# Altium schematic sheet Power-MCU-Breakout.SchDoc
size B
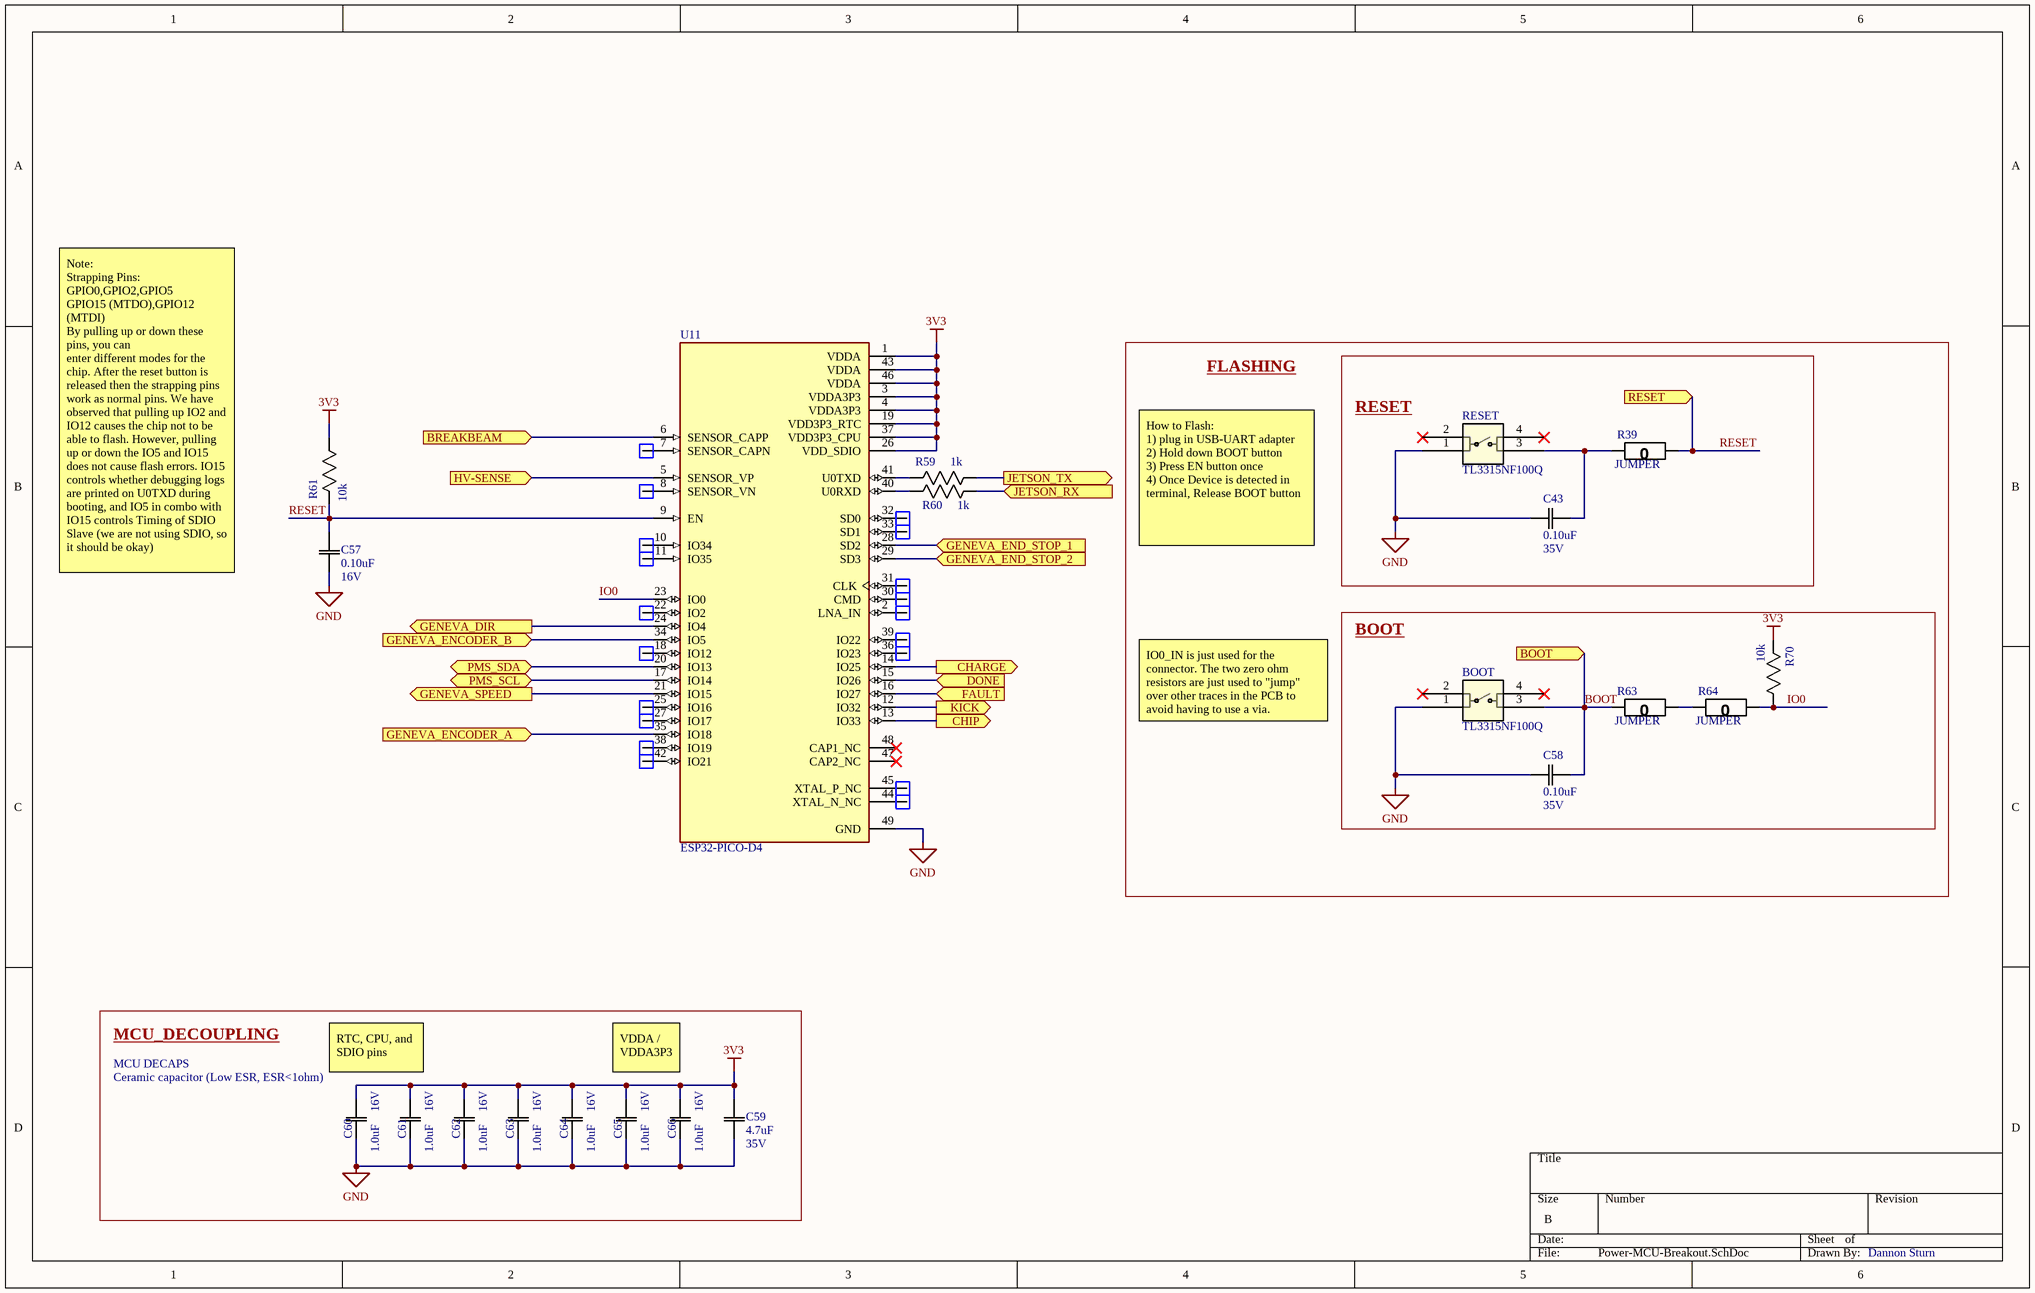
[diagram p0: Power-MCU-Breakout.SchDoc]

## Parts
1  Breakout Pin 0603  [BreakoutPin 0603]  (value not drawn)
2  Breakout Pin 0603  [BreakoutPin 0603]  (value not drawn)
3  Breakout Pin 0603  [BreakoutPin 0603]  (value not drawn)
7  Breakout Pin 0603  [BreakoutPin 0603]  (value not drawn)
8  Breakout Pin 0603  [BreakoutPin 0603]  (value not drawn)
10  Breakout Pin 0603  [BreakoutPin 0603]  (value not drawn)
11  Breakout Pin 0603  [BreakoutPin 0603]  (value not drawn)
18  Breakout Pin 0603  [BreakoutPin 0603]  (value not drawn)
22  Breakout Pin 0603  [BreakoutPin 0603]  (value not drawn)
25  Breakout Pin 0603  [BreakoutPin 0603]  (value not drawn)
27  Breakout Pin 0603  [BreakoutPin 0603]  (value not drawn)
30  Breakout Pin 0603  [BreakoutPin 0603]  (value not drawn)
31  Breakout Pin 0603  [BreakoutPin 0603]  (value not drawn)
32  Breakout Pin 0603  [BreakoutPin 0603]  (value not drawn)
33  Breakout Pin 0603  [BreakoutPin 0603]  (value not drawn)
36  Breakout Pin 0603  [BreakoutPin 0603]  (value not drawn)
42  Breakout Pin 0603  [BreakoutPin 0603]  (value not drawn)
44  Breakout Pin 0603  [BreakoutPin 0603]  (value not drawn)
45  Breakout Pin 0603  [BreakoutPin 0603]  (value not drawn)
BOOT  TL3315NF100Q  [SW_TL3315NF100Q]
C43  Rating: 35V  [0603]  (hidden comment: 0.10uF)
C57  Rating: 16V  [0603]  (hidden comment: 0.10uF)
C58  Rating: 35V  [0603]  (hidden comment: 0.10uF)
C59  Rating: 35V  [0603]  (hidden comment: 4.7uF)
C60  Rating: 16V  [0603]  (hidden comment: 1.0uF)
C61  Rating: 16V  [0603]  (hidden comment: 1.0uF)
C62  Rating: 16V  [0603]  (hidden comment: 1.0uF)
C63  Rating: 16V  [0603]  (hidden comment: 1.0uF)
C64  Rating: 16V  [0603]  (hidden comment: 1.0uF)
C65  Rating: 16V  [0603]  (hidden comment: 1.0uF)
C66  Rating: 16V  [0603]  (hidden comment: 1.0uF)
R39  JUMPER  [0603]
R59  1k  [0603]
R60  1k  [0603]
R61  10k  [0603]
R63  JUMPER  [0603]
R64  JUMPER  [0603]
R70  10k  [0603]
RESET  TL3315NF100Q  [SW_TL3315NF100Q]
U11  ESP32-PICO-D4  [PQFN50P700X700X104-49N - BigPads]

## Blocks framed on the sheet
RESET: C43 R39 RESET
BOOT: BOOT C58 R63 R64 R70
MCU_DECOUPLING: C59-C66

## Ports
BOOT (in), BREAKBEAM (in), CHARGE (out), CHIP (out), DONE (in), FAULT (in), GENEVA_DIR (out), GENEVA_ENCODER_A (in), GENEVA_ENCODER_B (in), GENEVA_END_STOP_1 (in), GENEVA_END_STOP_2 (in), GENEVA_SPEED (out), HV-SENSE (in), JETSON_RX (in), JETSON_TX (out), KICK (out), PMS_SCL (bidir), PMS_SDA (bidir), RESET (in)

## Nets
3V3: C59.2(C2) C60.2(C2) C61.2(C2) C62.2(C2) C63.2(C2) C64.2(C2) C65.2(C2) C66.2(C2) R61.1(R1) R70.2(R2) U11.1(VDDA) U11.3(VDDA3P3) U11.4(VDDA3P3) U11.19(VDD3P3_RTC) U11.26(VDD_SDIO) U11.37(VDD3P3_CPU) U11.43(VDDA) U11.46(VDDA)
GND: BOOT.1 C43.1(C1) C57.1(C1) C58.1(C1) C59.1(C1) C60.1(C1) C61.1(C1) C62.1(C1) C63.1(C1) C64.1(C1) C65.1(C1) C66.1(C1) RESET.1 U11.49(GND)
BOOT: BOOT.3 C58.2(C2) R63.2(R2) ; port BOOT
BREAKBEAM: U11.6(SENSOR_CAPP) ; port BREAKBEAM
CHARGE: U11.14(IO25) ; port CHARGE
CHIP: U11.13(IO33) ; port CHIP
DONE: U11.15(IO26) ; port DONE
FAULT: U11.16(IO27) ; port FAULT
GENEVA_DIR: U11.24(IO4) ; port GENEVA_DIR
GENEVA_ENCODER_A: U11.35(IO18) ; port GENEVA_ENCODER_A
GENEVA_ENCODER_B: U11.34(IO5) ; port GENEVA_ENCODER_B
GENEVA_END_STOP_1: U11.28(SD2) ; port GENEVA_END_STOP_1
GENEVA_END_STOP_2: U11.29(SD3) ; port GENEVA_END_STOP_2
GENEVA_SPEED: U11.21(IO15) ; port GENEVA_SPEED
HV-SENSE: U11.5(SENSOR_VP) ; port HV-SENSE
IO0: R64.1(R1) R70.1(R1) U11.23(IO0)
JETSON_RX: R60.1(R1) ; port JETSON_RX
JETSON_TX: R59.1(R1) ; port JETSON_TX
KICK: U11.12(IO32) ; port KICK
PMS_SCL: U11.17(IO14) ; port PMS_SCL
PMS_SDA: U11.20(IO13) ; port PMS_SDA
RESET: C57.2(C2) R39.1(R1) R61.2(R2) U11.9(EN) ; port RESET
Net1_1: 1.1(BRKOUT) U11.39(IO22)
Net2_1: 2.1(BRKOUT) U11.2(LNA_IN)
Net3_1: 3.1(BRKOUT) U11.38(IO19)
Net7_1: 7.1(BRKOUT) U11.7(SENSOR_CAPN)
Net8_1: 8.1(BRKOUT) U11.8(SENSOR_VN)
Net10_1: 10.1(BRKOUT) U11.10(IO34)
Net11_1: 11.1(BRKOUT) U11.11(IO35)
Net18_1: 18.1(BRKOUT) U11.18(IO12)
Net22_1: 22.1(BRKOUT) U11.22(IO2)
Net25_1: 25.1(BRKOUT) U11.25(IO16)
Net27_1: 27.1(BRKOUT) U11.27(IO17)
Net30_1: 30.1(BRKOUT) U11.30(CMD)
Net31_1: 31.1(BRKOUT) U11.31(CLK)
Net32_1: 32.1(BRKOUT) U11.32(SD0)
Net33_1: 33.1(BRKOUT) U11.33(SD1)
Net36_1: 36.1(BRKOUT) U11.36(IO23)
Net42_1: 42.1(BRKOUT) U11.42(IO21)
Net44_1: 44.1(BRKOUT) U11.44(XTAL_N_NC)
Net45_1: 45.1(BRKOUT) U11.45(XTAL_P_NC)
NetC43_2: C43.2(C2) R39.2(R2) RESET.3
NetR59_2: R59.2(R2) U11.41(U0TXD)
NetR60_2: R60.2(R2) U11.40(U0RXD)
NetR63_1: R63.1(R1) R64.2(R2)

Not connected (* = marked no-connect by the designer): BOOT 2* 4*; RESET 2* 4*; U11 47(CAP2_NC)* 48(CAP1_NC)*

## Notes on the sheet
- FLASHING
- Note:
  Strapping Pins:
  GPIO0,GPIO2,GPIO5
  GPIO15 (MTDO),GPIO12 (MTDI)
  By pulling up or down these pins, you can
  enter different modes for the chip. After the reset button is released then the strapping pins work as normal pins. We have observed that pulling up IO2 and IO12 causes the chip not to be able to flash. However, pulling up or down the IO5 and IO15 does not cause flash errors. IO15 controls whether debugging logs are printed on U0TXD during booting, and IO5 in combo with IO15 controls Timing of SDIO Slave (we are not using SDIO, so it should be okay)
- How to Flash:
  1) plug in USB-UART adapter
  2) Hold down BOOT button
  3) Press EN button once
  4) Once Device is detected in terminal, Release BOOT button
- IO0_IN is just used for the connector. The two zero ohm resistors are just used to "jump" over other traces in the PCB to avoid having to use a via.
- MCU DECAPS
- (near C60) Ceramic capacitor (Low ESR, ESR<1ohm)
- RTC, CPU, and SDIO pins
- VDDA / VDDA3P3
- Dannon Sturn

## Library data of the parts
1-3 7 8 10 11 18 22 25 27 30-33 36 42 44 45 = Breakout Pin 0603: 0603 breakout pad; Part Number: Breakout Pin 0603
BOOT RESET = SW PUSH TL3315: Tactile Switch SPST-NO Top Actuated Surface Mount, 0.55mm Height; Mfr_Name: E-Switch; Copyright: Copyright (C) 2022 Ultra Librarian. All rights reserved.; Manufacturer_Part_Number: TL3315NF100Q; Digi-Key_Part_Number_1: EG4620TR-ND; Digi-Key_Part_Number_2: EG4620CT-ND; Digi-Key_Part_Number_3: EG4620DKR-ND; RefDes: RefDes; Type: DEV; Supplier 1: Digi-key; Supplier Part Number 1: EG4620CT-ND; Part Number: SW PUSH TL3315; Manufacturer Part Number 1: TL3315NF100Q; Supplier URL 1: https://www.digikey.com/en/products/detail/e-switch/TL3315NF100Q/1870394
C43 = CAP 0.10uF 35V 0603: CAP CER 0.10UF 35V X7R 0603; Manufacturer Part Number 1: GMK107BJ104KAHT; Tolerance: 10%; Temperature Coefficient: X5R; Package: 0805; Operating Temperature: -55°C ~ 125°C; Supplier 1: Digi-Key; Value: 0.10uF; Supplier Part Number 1: 587-3357-1-ND; Part Number: CAP 0.10uF 35V 0603
C57 = CAP 0.10uF 16V: CAP CER 0.10UF 16V X5R 0603; Tolerance: 10%; Package: 0603/0805; Temperature Coefficient: X5R; Operating Temperature: -55°C ~ 85°C; Value: 0.10uF; Part Number: CAP 0.10uF 16V
C58 = CAP 0.10uF 35V: CAP CER 0.10UF 35V X7R 0603; Manufacturer Part Number 1: GMK107B7104KAHT; Tolerance: 10%; Package: 0603/0805; Temperature Coefficient: X7R; Operating Temperature: -55°C ~ 125°C; Value: 0.10uF; Part Number: CAP 0.10uF 35V; Supplier 1: Digi-Key; Supplier Part Number 1: 587-3354-1-ND; Manufacturer Part Number 2: GMK212BJ104KGHT; Supplier 2: Digi-Key; Supplier Part Number 2: 587-3364-1-ND
C59 = CAP 4.7uF 35V: CAP CER 4.7UF 35V X7R 0603/0805; Tolerance: 10%; Package: 0603/0805; Temperature Coefficient: X7R; Operating Temperature: -55°C ~ 125°C; Value: 4.7uF; Part Number: CAP 4.7uF 35V
C60-C66 = CAP 1.0uF 16V: CAP CER 1.0UF 16V X5R 0603/0805; Tolerance: 10%; Package: 0603/0805; Temperature Coefficient: X5R; Operating Temperature: -55°C ~ 85°C; Value: 1.0uF; Part Number: CAP 1.0uF 16V
R39 R63 R64 = RES 0 JUMPER: RES SMD 0 OHM JUMPER GENERIC 0603; Manufacturer Part Number 1: RK73Z1JTTD; Value: 0; Package: 0805; Part Number: RES 0 JUMPER; Tolerance: N/A; Supplier 1: Digi-Key; Supplier Part Number 1: 2019-RK73Z1JTTDCT-ND; Supplier URL 1: https://www.digikey.ca/en/products/detail/koa-speer-electronics-inc/RK73Z1JTTD/9845478
R59 R60 = RES 1k 1/8W: RES SMD 1K OHM 1% 1/8W 0603; Manufacturer Part Number 1: MCT06030C1001FP500; Power (Watts): 0.125W; Package: 0805; Value: 1k; Tolerance: 1%; Part Number: RES 1k 1/8W; Supplier 1: Digi-Key; Supplier Part Number 1: MCT0603-1.00K-CFCT-ND; Supplier URL 1: https://www.digikey.ca/en/products/detail/vishay-beyschlag-draloric-bc-components/MCT06030C1001FP500/2607821?s=N4IgTCBcDaILIGEAqAGAbCgzAWgIwDoUUBpbBAMWWwDkAREAXQF8g
R61 R70 = RES 10k 1/8W - 5%: RES SMD 10K OHM 5% 1/8W 0603; Power (Watts): 0.125W; Package: 0805; Value: 10k; Tolerance: 5%; Part Number: RES 10k 1/8W - 5%
U11 = ESP32-PICO-D4: RX TXRX MOD WIFI SURFACE MOUNT; MF: Espressif Systems; MP: ESP32-PICO-D4; Package: SMD-48 Espressif Systems; Availability: Warning; Price: None; Purchase-URL: https://pricing.snapeda.com/search/part/ESP32-PICO-D4/?ref=eda; Check_prices: https://www.snapeda.com/parts/ESP32-PICO-D4/Espressif%20Systems/view-part/2762121/?ref=eda; SnapEDA_Link: https://www.snapeda.com/parts/ESP32-PICO-D4/Espressif%20Systems/view-part/2762121/?ref=snap; Value: *; Part Number: ESP32-PICO-D4; Manufacturer Part Number 1: ESP32-PICO-D4; Supplier 1: Digi-key; Supplier Part Number 1: 1904-1029-1-ND; Supplier URL 1: https://www.digikey.com/en/products/detail/espressif-systems/ESP32-PICO-D4/9381722